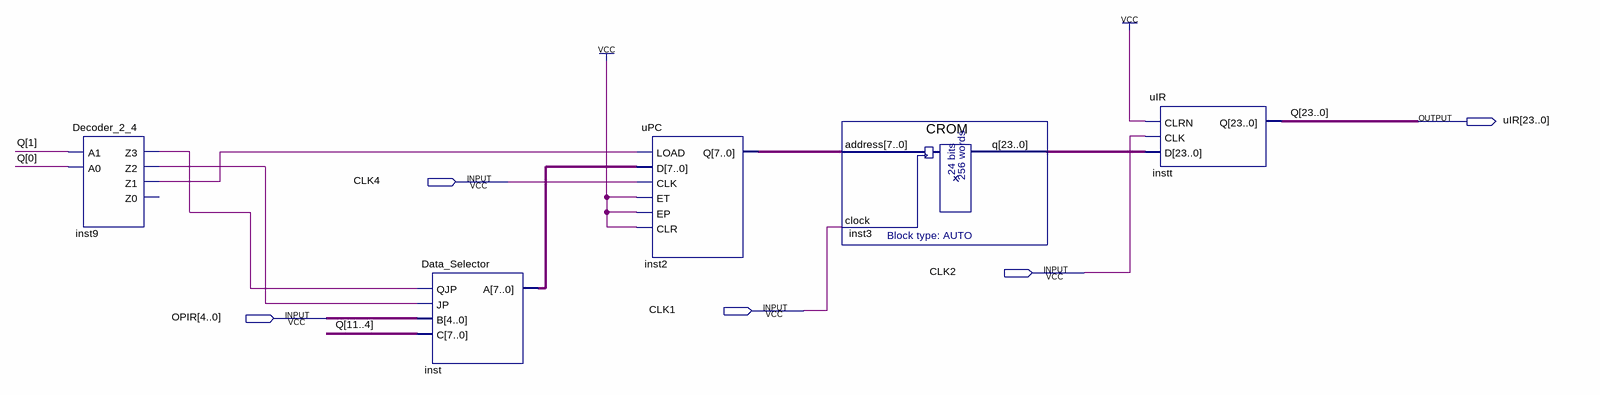
[diagram p0: schematic sheet]
// Quartus schematic CU.bdf as structural Verilog: 5 symbols, 5 pins
module CU (
  input  CLK4,
  input  CLK2,
  input  CLK1,
  input  [4:0] OPIR,
  output [23:0] uIR
);

  wire inst9_z1, inst9_z2, inst9_z3;
  wire [7:0] inst2_q, inst_a;
  wire [23:0] inst3_q;

  Decoder_2_4 inst9 (.A1(uIR[1]), .A0(uIR[0]), .Z3(inst9_z3), .Z2(inst9_z2), .Z1(inst9_z1));  // open: Z0
  Data_Selector inst (.QJP(inst9_z3), .JP(inst9_z2), .B(OPIR), .C(uIR[11:4]), .A(inst_a));
  uPC inst2 (.LOAD(inst9_z1), .D(inst_a), .CLK(CLK4), .ET(1'b1), .EP(1'b1), .CLR(1'b1), .Q(inst2_q));
  CROM inst3 (.address(inst2_q), .clock(CLK1), .q(inst3_q));
  uIR instt (.CLRN(1'b1), .CLK(CLK2), .D(inst3_q), .Q(uIR));

  // Other names for the same wires on the sheet: Q[23:0] = uIR
endmodule
